# EAGLE design whip-o-diffusor_v1.0 (EAGLE 5.11)
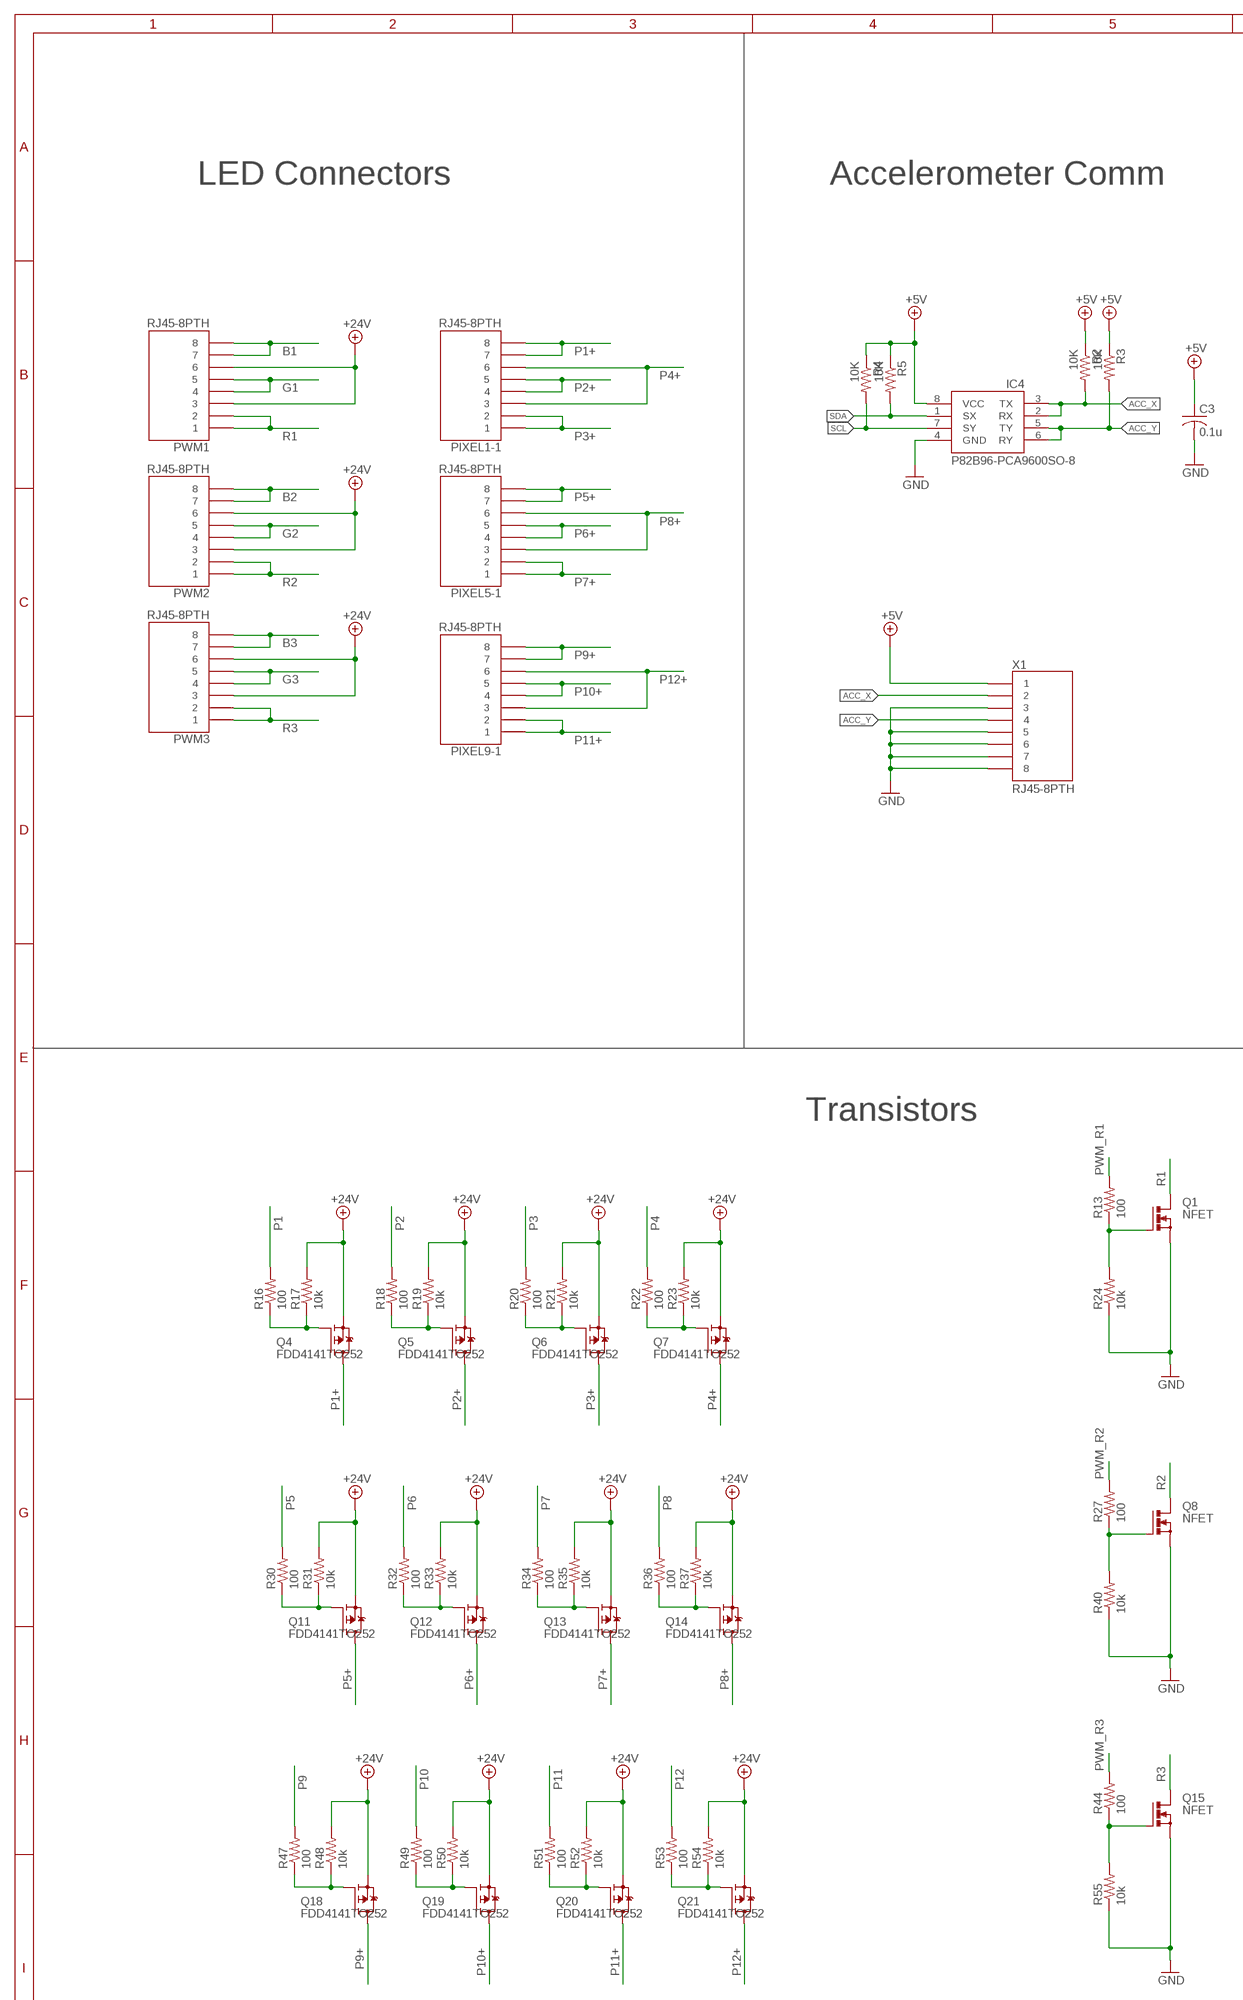
[diagram p0: schematic, sheet 1, part 1 of 2]
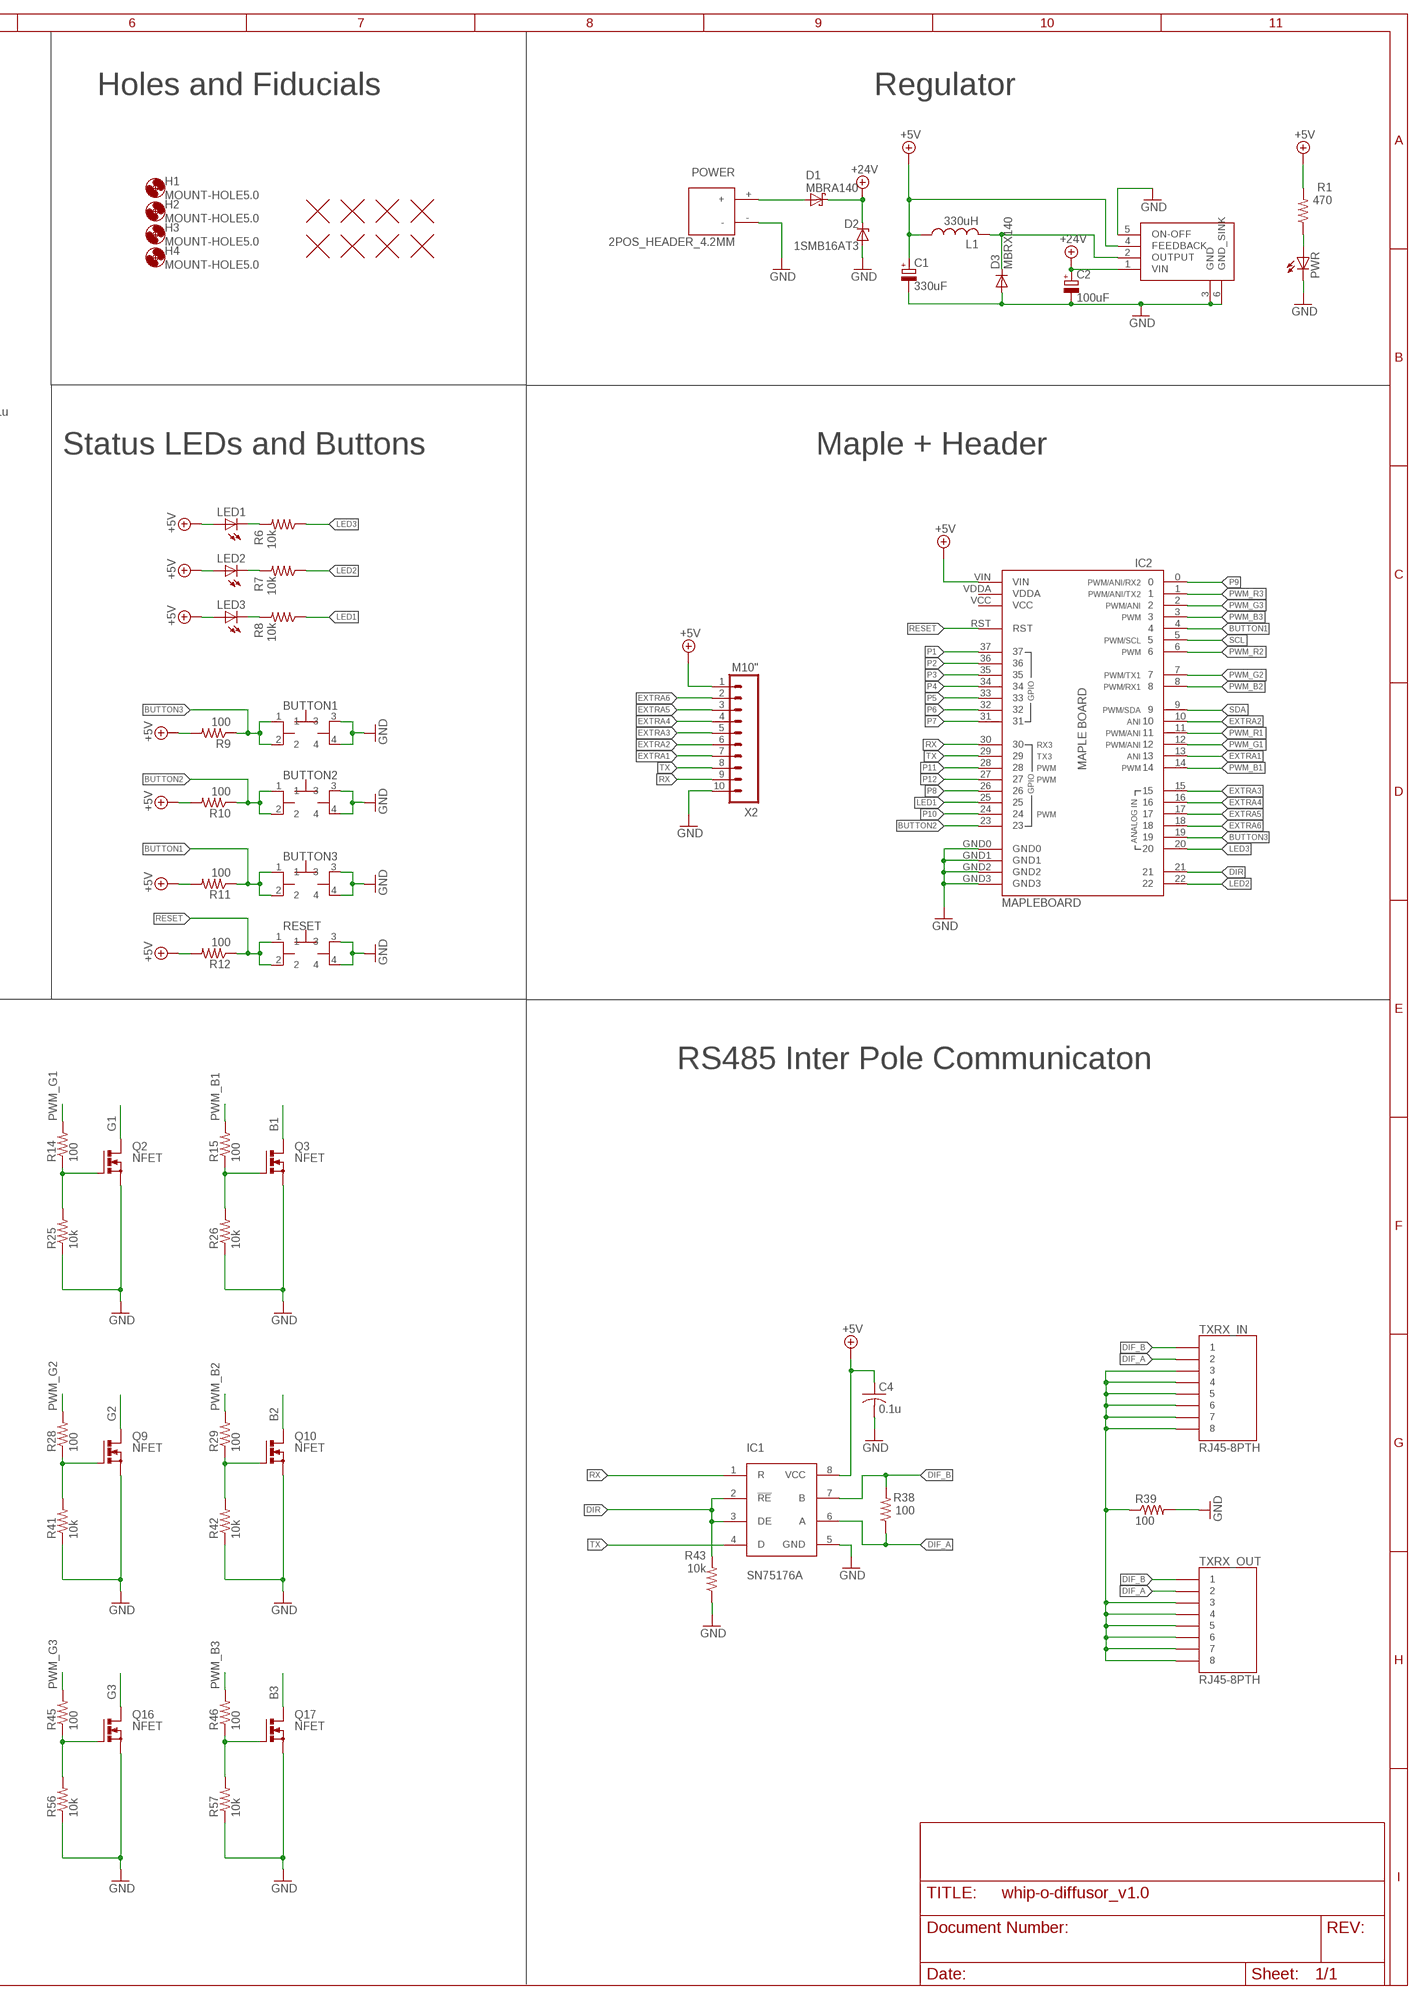
[diagram p1: schematic, sheet 1, part 2 of 2]

## Parts
BUTTON1  TL3301  [TL3301]
BUTTON2  TL3301  [TL3301]
BUTTON3  TL3301  [TL3301]
C1  330uF  CPOL-EUE  [PANASONIC_E]
C2  100uF  CPOL-EUD  [PANASONIC_D]
C3  0.1u  C-USC0805  [C0805]
C4  0.1u  C-USC0805  [C0805]
D1  MBRA140  [SMA]
D2  1SMB16AT3  ZENER-DIODESMB  [SMB]
D3  MBRX140  DIODE-SOD123  [SOD123]
H1  MOUNT-HOLE5.0  [5,0]
H2  MOUNT-HOLE5.0  [5,0]
H3  MOUNT-HOLE5.0  [5,0]
H4  MOUNT-HOLE5.0  [5,0]
IC1  SN75176A  [SO-08]
IC2  MAPLEBOARD  [MAPLEBOARD]
IC3  TL2575  [TO-263-5]
IC4  P82B96-PCA9600SO-8  [SO-8]
L1  330uH  L-USL4532P  [L4532P]
LED1  LEDCHIP-LED0805  [CHIP-LED0805]
LED2  LEDCHIP-LED0805  [CHIP-LED0805]
LED3  LEDCHIP-LED0805  [CHIP-LED0805]
PIXEL1-1  RJ45-8PTH  [RJ45-8]
PIXEL5-1  RJ45-8PTH  [RJ45-8]
PIXEL9-1  RJ45-8PTH  [RJ45-8]
POWER  2POS_HEADER_4.2MM  [2POS_HEADER_4.2MM]
PWM1  RJ45-8PTH  [RJ45-8]
PWM2  RJ45-8PTH  [RJ45-8]
PWM3  RJ45-8PTH  [RJ45-8]
PWR  LEDCHIP-LED0805  [CHIP-LED0805]
Q1  NFET  [TO252]
Q2  NFET  [TO252]
Q3  NFET  [TO252]
Q4  FDD4141TO252  [TO252]
Q5  FDD4141TO252  [TO252]
Q6  FDD4141TO252  [TO252]
Q7  FDD4141TO252  [TO252]
Q8  NFET  [TO252]
Q9  NFET  [TO252]
Q10  NFET  [TO252]
Q11  FDD4141TO252  [TO252]
Q12  FDD4141TO252  [TO252]
Q13  FDD4141TO252  [TO252]
Q14  FDD4141TO252  [TO252]
Q15  NFET  [TO252]
Q16  NFET  [TO252]
Q17  NFET  [TO252]
Q18  FDD4141TO252  [TO252]
Q19  FDD4141TO252  [TO252]
Q20  FDD4141TO252  [TO252]
Q21  FDD4141TO252  [TO252]
R1  470  R-US_R0805  [R0805]
R2  10K  R-US_R0603  [R0603]
R3  10K  R-US_R0603  [R0603]
R4  10K  R-US_R0603  [R0603]
R5  10K  R-US_R0603  [R0603]
R6  10k  R-US_R0805  [R0805]
R7  10k  R-US_R0805  [R0805]
R8  10k  R-US_R0805  [R0805]
R9  100  R-US_R0603  [R0603]
R10  100  R-US_R0603  [R0603]
R11  100  R-US_R0603  [R0603]
R12  100  R-US_R0603  [R0603]
R13  100  R-US_R0603  [R0603]
R14  100  R-US_R0603  [R0603]
R15  100  R-US_R0603  [R0603]
R16  100  R-US_R0603  [R0603]
R17  10k  R-US_R0603  [R0603]
R18  100  R-US_R0603  [R0603]
R19  10k  R-US_R0603  [R0603]
R20  100  R-US_R0603  [R0603]
R21  10k  R-US_R0603  [R0603]
R22  100  R-US_R0603  [R0603]
R23  10k  R-US_R0603  [R0603]
R24  10k  R-US_R0603  [R0603]
R25  10k  R-US_R0603  [R0603]
R26  10k  R-US_R0603  [R0603]
R27  100  R-US_R0603  [R0603]
R28  100  R-US_R0603  [R0603]
R29  100  R-US_R0603  [R0603]
R30  100  R-US_R0603  [R0603]
R31  10k  R-US_R0603  [R0603]
R32  100  R-US_R0603  [R0603]
R33  10k  R-US_R0603  [R0603]
R34  100  R-US_R0603  [R0603]
R35  10k  R-US_R0603  [R0603]
R36  100  R-US_R0603  [R0603]
R37  10k  R-US_R0603  [R0603]
R38  100  R-US_R0805  [R0805]
R39  100  R-US_R2512  [R2512]
R40  10k  R-US_R0603  [R0603]
R41  10k  R-US_R0603  [R0603]
R42  10k  R-US_R0603  [R0603]
R43  10k  R-US_R0805  [R0805]
R44  100  R-US_R0603  [R0603]
R45  100  R-US_R0603  [R0603]
R46  100  R-US_R0603  [R0603]
R47  100  R-US_R0603  [R0603]
R48  10k  R-US_R0603  [R0603]
R49  100  R-US_R0603  [R0603]
R50  10k  R-US_R0603  [R0603]
R51  100  R-US_R0603  [R0603]
R52  10k  R-US_R0603  [R0603]
R53  100  R-US_R0603  [R0603]
R54  10k  R-US_R0603  [R0603]
R55  10k  R-US_R0603  [R0603]
R56  10k  R-US_R0603  [R0603]
R57  10k  R-US_R0603  [R0603]
RESET  TL3301  [TL3301]
TXRX_IN  RJ45-8PTH  [RJ45-8]
TXRX_OUT  RJ45-8PTH  [RJ45-8]
U$1  FIDUCIAL1X2  [FIDUCIAL-1X2]
U$2  FIDUCIAL1X2  [FIDUCIAL-1X2]
U$3  FIDUCIAL1X2  [FIDUCIAL-1X2]
U$4  FIDUCIAL1X2  [FIDUCIAL-1X2]
U$5  FIDUCIAL1X2  [FIDUCIAL-1X2]
U$6  FIDUCIAL1X2  [FIDUCIAL-1X2]
U$7  FIDUCIAL1X2  [FIDUCIAL-1X2]
U$8  FIDUCIAL1X2  [FIDUCIAL-1X2]
X1  RJ45-8PTH  [RJ45-8]
X2  M10"  [1X10]

## Nets
+5V: C1.+ C3.1 C4.1 IC1.8(VCC) IC2.VIN IC3.4(FEEDBACK) IC4.8(VCC) L1.1 LED1.A LED2.A LED3.A R1.2 R2.1 R3.1 R4.1 R5.1 R9.2 R10.2 R11.2 R12.2 X1.1 X2.1
+24V: C2.+ D1.K(C) D2.C IC3.1(VIN) PWM1.3 PWM1.6 PWM2.3 PWM2.6 PWM3.3 PWM3.6 Q4.S Q5.S Q6.S Q7.S Q11.S Q12.S Q13.S Q14.S Q18.S Q19.S Q20.S Q21.S R17.2 R19.2 R21.2 R23.2 R31.2 R33.2 R35.2 R37.2 R48.2 R50.2 R52.2 R54.2
ACC_X: IC4.2(RX) IC4.3(TX) R2.2 X1.2
ACC_Y: IC4.5(TY) IC4.6(RY) R3.2 X1.4
B1: PWM1.7 PWM1.8 Q3.2(D)
B2: PWM2.7 PWM2.8 Q10.2(D)
B3: PWM3.7 PWM3.8 Q17.2(D)
BUTTON1: BUTTON3.1 BUTTON3.2 IC2.4 R11.1
BUTTON2: BUTTON2.1 BUTTON2.2 IC2.23 R10.1
BUTTON3: BUTTON1.1 BUTTON1.2 IC2.19 R9.1
DIF_A: IC1.6(A) R38.1 TXRX_IN.2 TXRX_OUT.2
DIF_B: IC1.7(B) R38.2 TXRX_IN.1 TXRX_OUT.1
DIR: IC1.2(!RE) IC1.3(DE) IC2.21 R43.2
EXTRA1: IC2.13 X2.7
EXTRA2: IC2.10 X2.6
EXTRA3: IC2.15 X2.5
EXTRA4: IC2.16 X2.4
EXTRA5: IC2.17 X2.3
EXTRA6: IC2.18 X2.2
G1: PWM1.4 PWM1.5 Q2.2(D)
G2: PWM2.4 PWM2.5 Q9.2(D)
G3: PWM3.4 PWM3.5 Q16.2(D)
GND: BUTTON1.3 BUTTON1.4 BUTTON2.3 BUTTON2.4 BUTTON3.3 BUTTON3.4 C1.- C2.- C3.2 C4.2 D2.A D3.A IC1.5(GND) IC2.GND0 IC2.GND1 IC2.GND2 IC2.GND3 IC3.3(GND) IC3.5(ON-OFF) IC3.6(GND_SINK) IC4.4(GND) POWER.- PWR.C Q1.3(S) Q2.3(S) Q3.3(S) Q8.3(S) Q9.3(S) Q10.3(S) Q15.3(S) Q16.3(S) Q17.3(S) R24.1 R25.1 R26.1 R39.2 R40.1 R41.1 R42.1 R43.1 R55.1 R56.1 R57.1 RESET.3 RESET.4 X1.3 X1.5 X1.6 X1.7 X1.8 X2.10
LED1: IC2.25 R8.1
LED2: IC2.22 R7.1
LED3: IC2.20 R6.1
N$1: PWR.A R1.1
N$2: Q2.1(G) R14.1 R25.2
N$3: Q18.G R47.1 R48.1
N$4: D3.C IC3.2(OUTPUT) L1.2
N$5: D1.A POWER.+
N$6: Q19.G R49.1 R50.1
N$7: R39.1 TXRX_IN.3 TXRX_IN.4 TXRX_IN.5 TXRX_IN.6 TXRX_IN.7 TXRX_IN.8 TXRX_OUT.3 TXRX_OUT.4 TXRX_OUT.5 TXRX_OUT.6 TXRX_OUT.7 TXRX_OUT.8
N$8: Q3.1(G) R15.1 R26.2
N$9: Q20.G R51.1 R52.1
N$10: Q8.1(G) R27.1 R40.2
N$11: LED3.C R8.2
N$12: Q9.1(G) R28.1 R41.2
N$13: Q13.G R34.1 R35.1
N$14: Q10.1(G) R29.1 R42.2
N$15: Q14.G R36.1 R37.1
N$16: Q15.1(G) R44.1 R55.2
N$17: Q21.G R53.1 R54.1
N$18: Q16.1(G) R45.1 R56.2
N$19: Q1.1(G) R13.1 R24.2
N$20: LED2.C R7.2
N$21: Q17.1(G) R46.1 R57.2
N$22: Q5.G R18.1 R19.1
N$23: Q6.G R20.1 R21.1
N$24: Q4.G R16.1 R17.1
N$25: Q7.G R22.1 R23.1
N$26: Q11.G R30.1 R31.1
N$27: Q12.G R32.1 R33.1
N$28: LED1.C R6.2
P1: IC2.37 R16.2
P1+: PIXEL1-1.7 PIXEL1-1.8 Q4.D
P2: IC2.36 R18.2
P2+: PIXEL1-1.4 PIXEL1-1.5 Q5.D
P3: IC2.35 R20.2
P3+: PIXEL1-1.1 PIXEL1-1.2 Q6.D
P4: IC2.34 R22.2
P4+: PIXEL1-1.3 PIXEL1-1.6 Q7.D
P5: IC2.33 R30.2
P5+: PIXEL5-1.7 PIXEL5-1.8 Q11.D
P6: IC2.32 R32.2
P6+: PIXEL5-1.4 PIXEL5-1.5 Q12.D
P7: IC2.31 R34.2
P7+: PIXEL5-1.1 PIXEL5-1.2 Q13.D
P8: IC2.26 R36.2
P8+: PIXEL5-1.3 PIXEL5-1.6 Q14.D
P9: IC2.0 R47.2
P9+: PIXEL9-1.7 PIXEL9-1.8 Q18.D
P10: IC2.24 R49.2
P10+: PIXEL9-1.4 PIXEL9-1.5 Q19.D
P11: IC2.28 R51.2
P11+: PIXEL9-1.1 PIXEL9-1.2 Q20.D
P12: IC2.27 R53.2
P12+: PIXEL9-1.3 PIXEL9-1.6 Q21.D
PWM_B1: IC2.14 R15.2
PWM_B2: IC2.8 R29.2
PWM_B3: IC2.3 R46.2
PWM_G1: IC2.12 R14.2
PWM_G2: IC2.7 R28.2
PWM_G3: IC2.2 R45.2
PWM_R1: IC2.11 R13.2
PWM_R2: IC2.6 R27.2
PWM_R3: IC2.1 R44.2
R1: PWM1.1 PWM1.2 Q1.2(D)
R2: PWM2.1 PWM2.2 Q8.2(D)
R3: PWM3.1 PWM3.2 Q15.2(D)
RESET: IC2.RST R12.1 RESET.1 RESET.2
RX: IC1.1(R) IC2.30 X2.9
SCL: IC2.5 IC4.7(SY) R4.2
SDA: IC2.9 IC4.1(SX) R5.2
TX: IC1.4(D) IC2.29 X2.8
Unconnected: IC2.VCC IC2.VDDA

## Notes on the sheet
- Holes and Fiducials | Regulator
- LED Connectors | Accelerometer Comm
- Status LEDs and Buttons | Maple + Header
- Transistors | RS485 Inter Pole Communicaton

## Library data of the parts
BUTTON1-BUTTON3 RESET = E-switch:TL3301
C1 C2 = rcl:CPOL-EU: POLARIZED CAPACITOR, European symbol
C3 C4 = rcl:C-US: CAPACITOR, American symbol
D1 = diode:MBRA140
D2 = diode:ZENER-DIODE: Z-Diode
D3 = diode:DIODE-: DIODE
H1-H4 = holes:MOUNT-HOLE: MOUNTING HOLE with drill center marker
IC1 = texas:SN75176A: Transceiver RS422
IC2 = NITWHIPS:MAPLEBOARD
IC3 = vincent:TL2575
IC4 = Sparky:P82B96-PCA9600: P822B96 and PCA9600, bipolar IC creating a non-latching, bidirectional, logic interface between the normal I2C bus and a range of other bus configuration icluding rs485.
L1 = rcl:L-US: INDUCTOR, American symbol
LED1-LED3 PWR = led:LED: LED OSRAM: - CHIPLED LG R971, LG N971, LY N971, LG Q971, LY Q971, LO R971, LY R971 LH N974, LH R974 LS Q976, LO Q976, LY Q976 LO Q996 - Hyper CHIPLED LW Q18S LB Q993, LB Q99A, LB R99A - SideLED LS A670, LO A670, LY A670, LG A670, LP A670 LB A673, LV A673, LT A673, LW A673 LH A674 LY A675 LS A676, LA A676, LO A676, LY A676, LW A676 LS A679, LY A679, LG A679 - Hyper Micro SIDELED® LS Y876, LA Y876, LO Y876, LY Y876 LT Y87S - SmartLED LW L88C, LW L88S LB L89C, LB L89S, LG L890 LS L89K, LO L89K, LY L89K LS L896, LA L896, LO L896, LY L896 - TOPLED LS T670, LO T670, LY T670, LG T670, LP T670 LSG T670, LSP T670, LSY T670, LOP T670, LYG T670 LG T671, LOG T671, LSG T671 LB T673, LV T673, LT T673, LW T673 LH T674 LS T676, LA T676, LO T676, LY T676, LB T676, LH T676, LSB T676, LW T676 LB T67C, LV T67C, LT T67C, LS T67K, LO T67K, LY T67K, LW E67C LS E67B, LA E67B, LO E67B, LY E67B, LB E67C, LV E67C, LT E67C LW T67C LS T679, LY T679, LG T679 LS T770, LO T770, LY T770, LG T770, LP T770 LB T773, LV T773, LT T773, LW T773 LH T774 LS E675, LA E675, LY E675, LS T675 LS T776, LA T776, LO T776, LY T776, LB T776 LHGB T686 LT T68C, LB T68C - Hyper Mini TOPLED® LB M676 - Mini TOPLED Santana® LG M470 LS M47K, LO M47K, LY M47K Source: http://www.osram.convergy.de LUXEON: - LUMILED® LXK2-PW12-R00, LXK2-PW12-S00, LXK2-PW14-U00, LXK2-PW14-V00 LXK2-PM12-R00, LXK2-PM12-S00, LXK2-PM14-U00 LXK2-PE12-Q00, LXK2-PE12-R00, LXK2-PE12-S00, LXK2-PE14-T00, LXK2-PE14-U00 LXK2-PB12-K00, LXK2-PB12-L00, LXK2-PB12-M00, LXK2-PB14-N00, LXK2-PB14-P00, LXK2-PB14-Q00 LXK2-PR12-L00, LXK2-PR12-M00, LXK2-PR14-Q00, LXK2-PR14-R00 LXK2-PD12-Q00, LXK2-PD12-R00, LXK2-PD12-S00 LXK2-PH12-R00, LXK2-PH12-S00 LXK2-PL12-P00, LXK2-PL12-Q00, LXK2-PL12-R00 Source: www.luxeon.com KINGBRIGHT: KA-3528ASYC Source: www.kingbright.com
PIXEL1-1 PIXEL5-1 PIXEL9-1 PWM1-PWM3 TXRX_IN TXRX_OUT X1 = SparkFun:RJ45-8: RJ45 Jack Simple RJ45, 8-pin connection - connector for common Cat5, Cat5e, and Cat6 Ethernet cables. Footprint not yet proven in production. Connector sku is PRT-00643; Breakout PCB sku is BOB-00716.
POWER = vadim:2POS_HEADER_4.2MM
Q1-Q3 Q8-Q10 Q15-Q17 = vincent:NFET
Q4-Q7 Q11-Q14 Q18-Q21 = transistor-fet:FDD4141: P-Channel PowerTrench® MOSFET Source: FDD4141.pdf
R1-R57 = rcl:R-US_: RESISTOR, American symbol
U$1-U$8 = SparkFunEagle-6-6-07:FIDUCIAL: Fiducial Alignment Points Various fiducial points for machine vision alignment.
X2 = SparkFun:M10: Header 10 Standard 10-pin 0.1" header. Use with straight break away headers (SKU : PRT-00116), right angle break away headers (PRT-00553), swiss pins (PRT-00743), machine pins (PRT-00117), and female headers (PRT-00115).

## Net classes
1 power: width 1.27 mm, clearance 0.254 mm

## Board
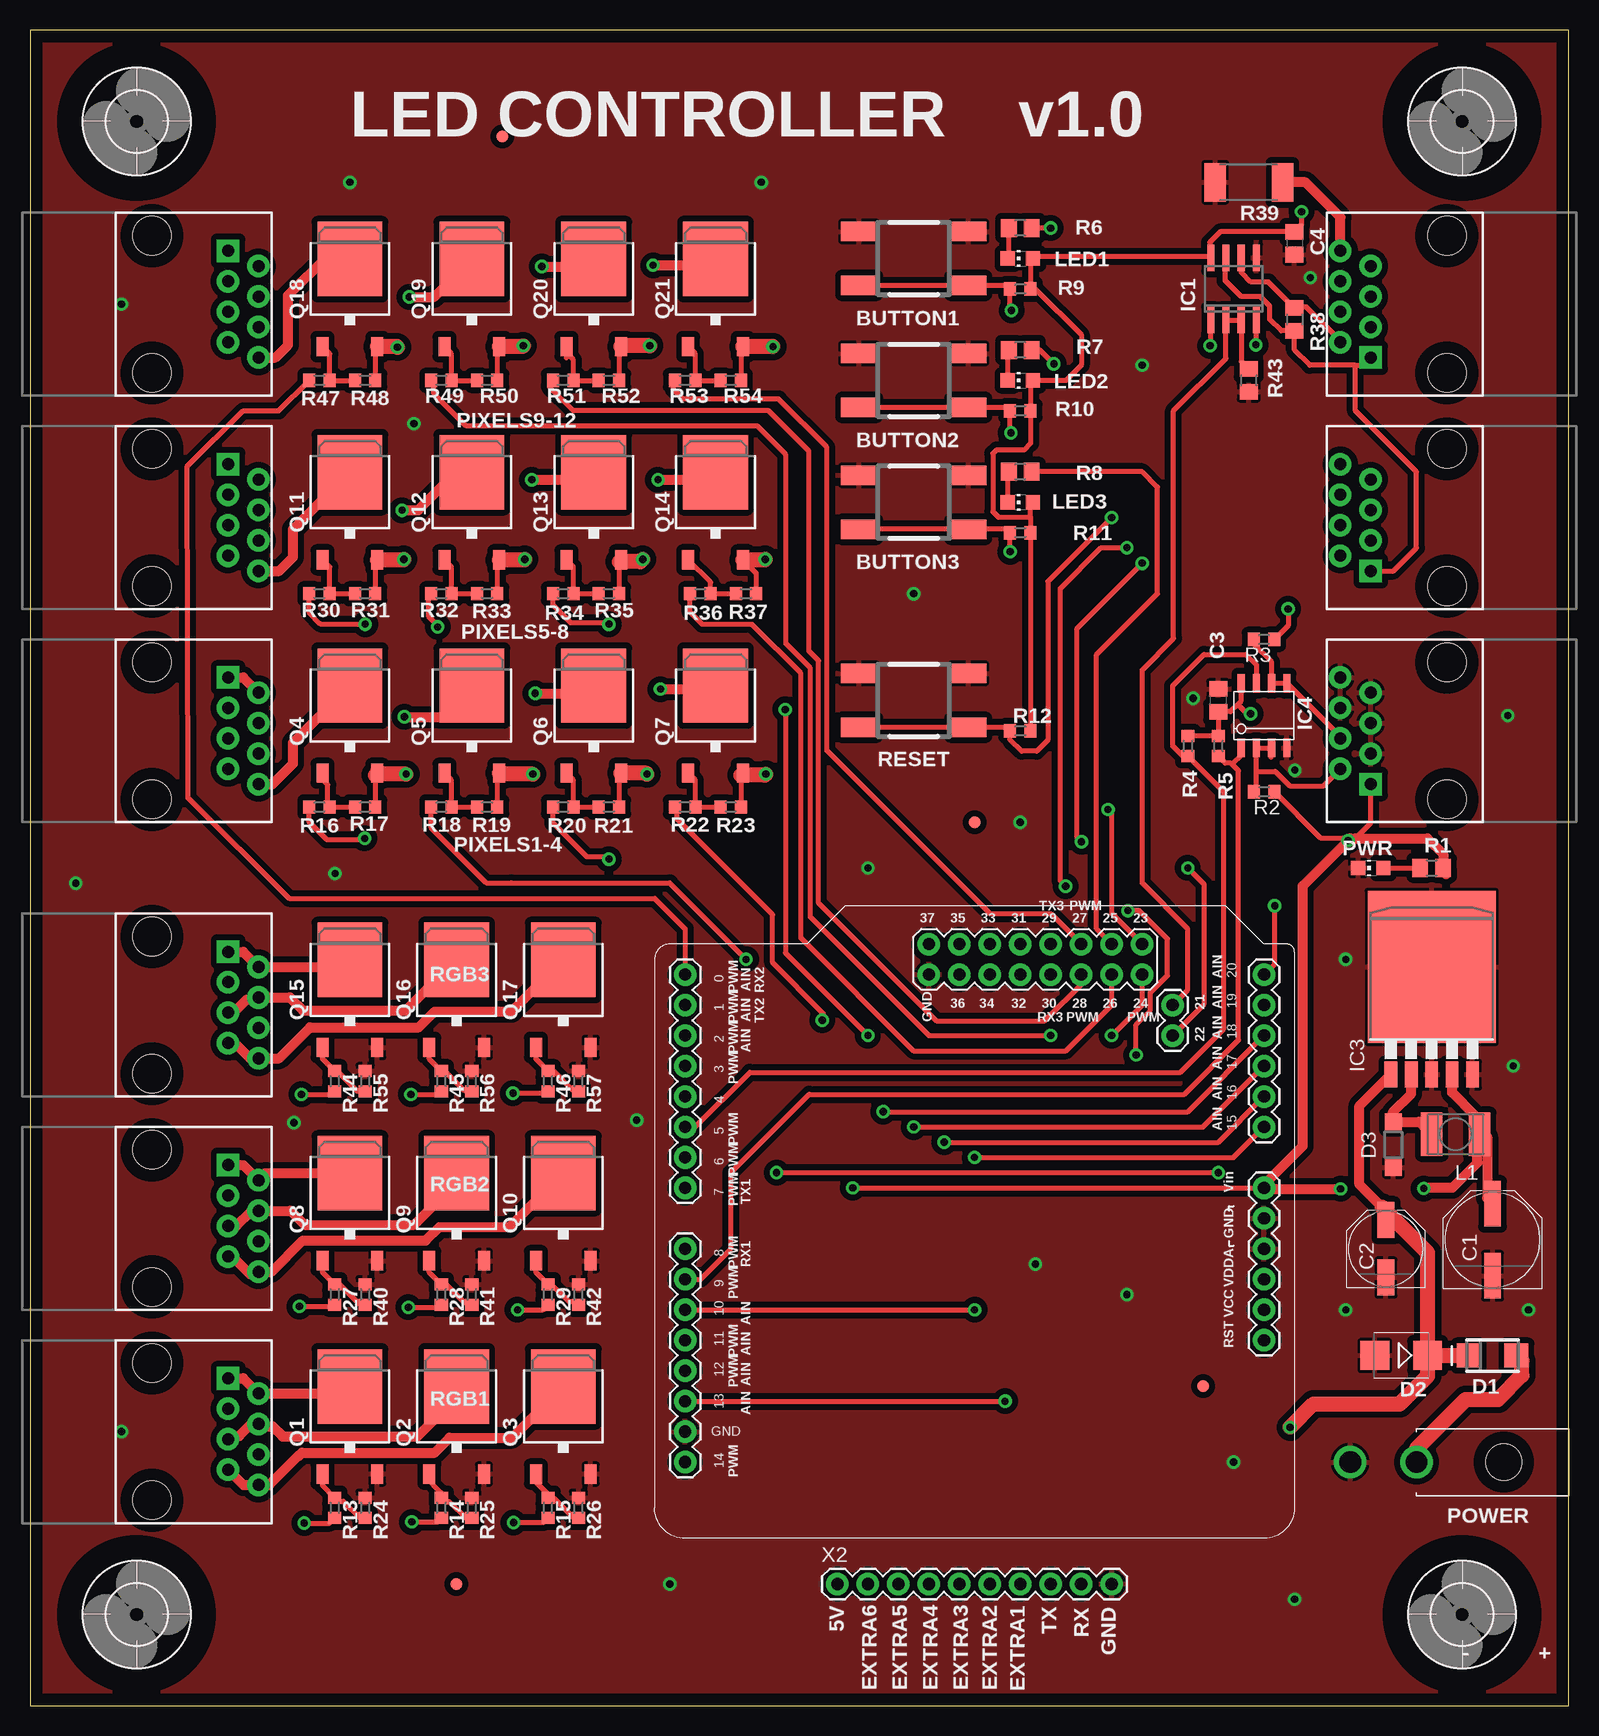
[diagram p2: board, top side]
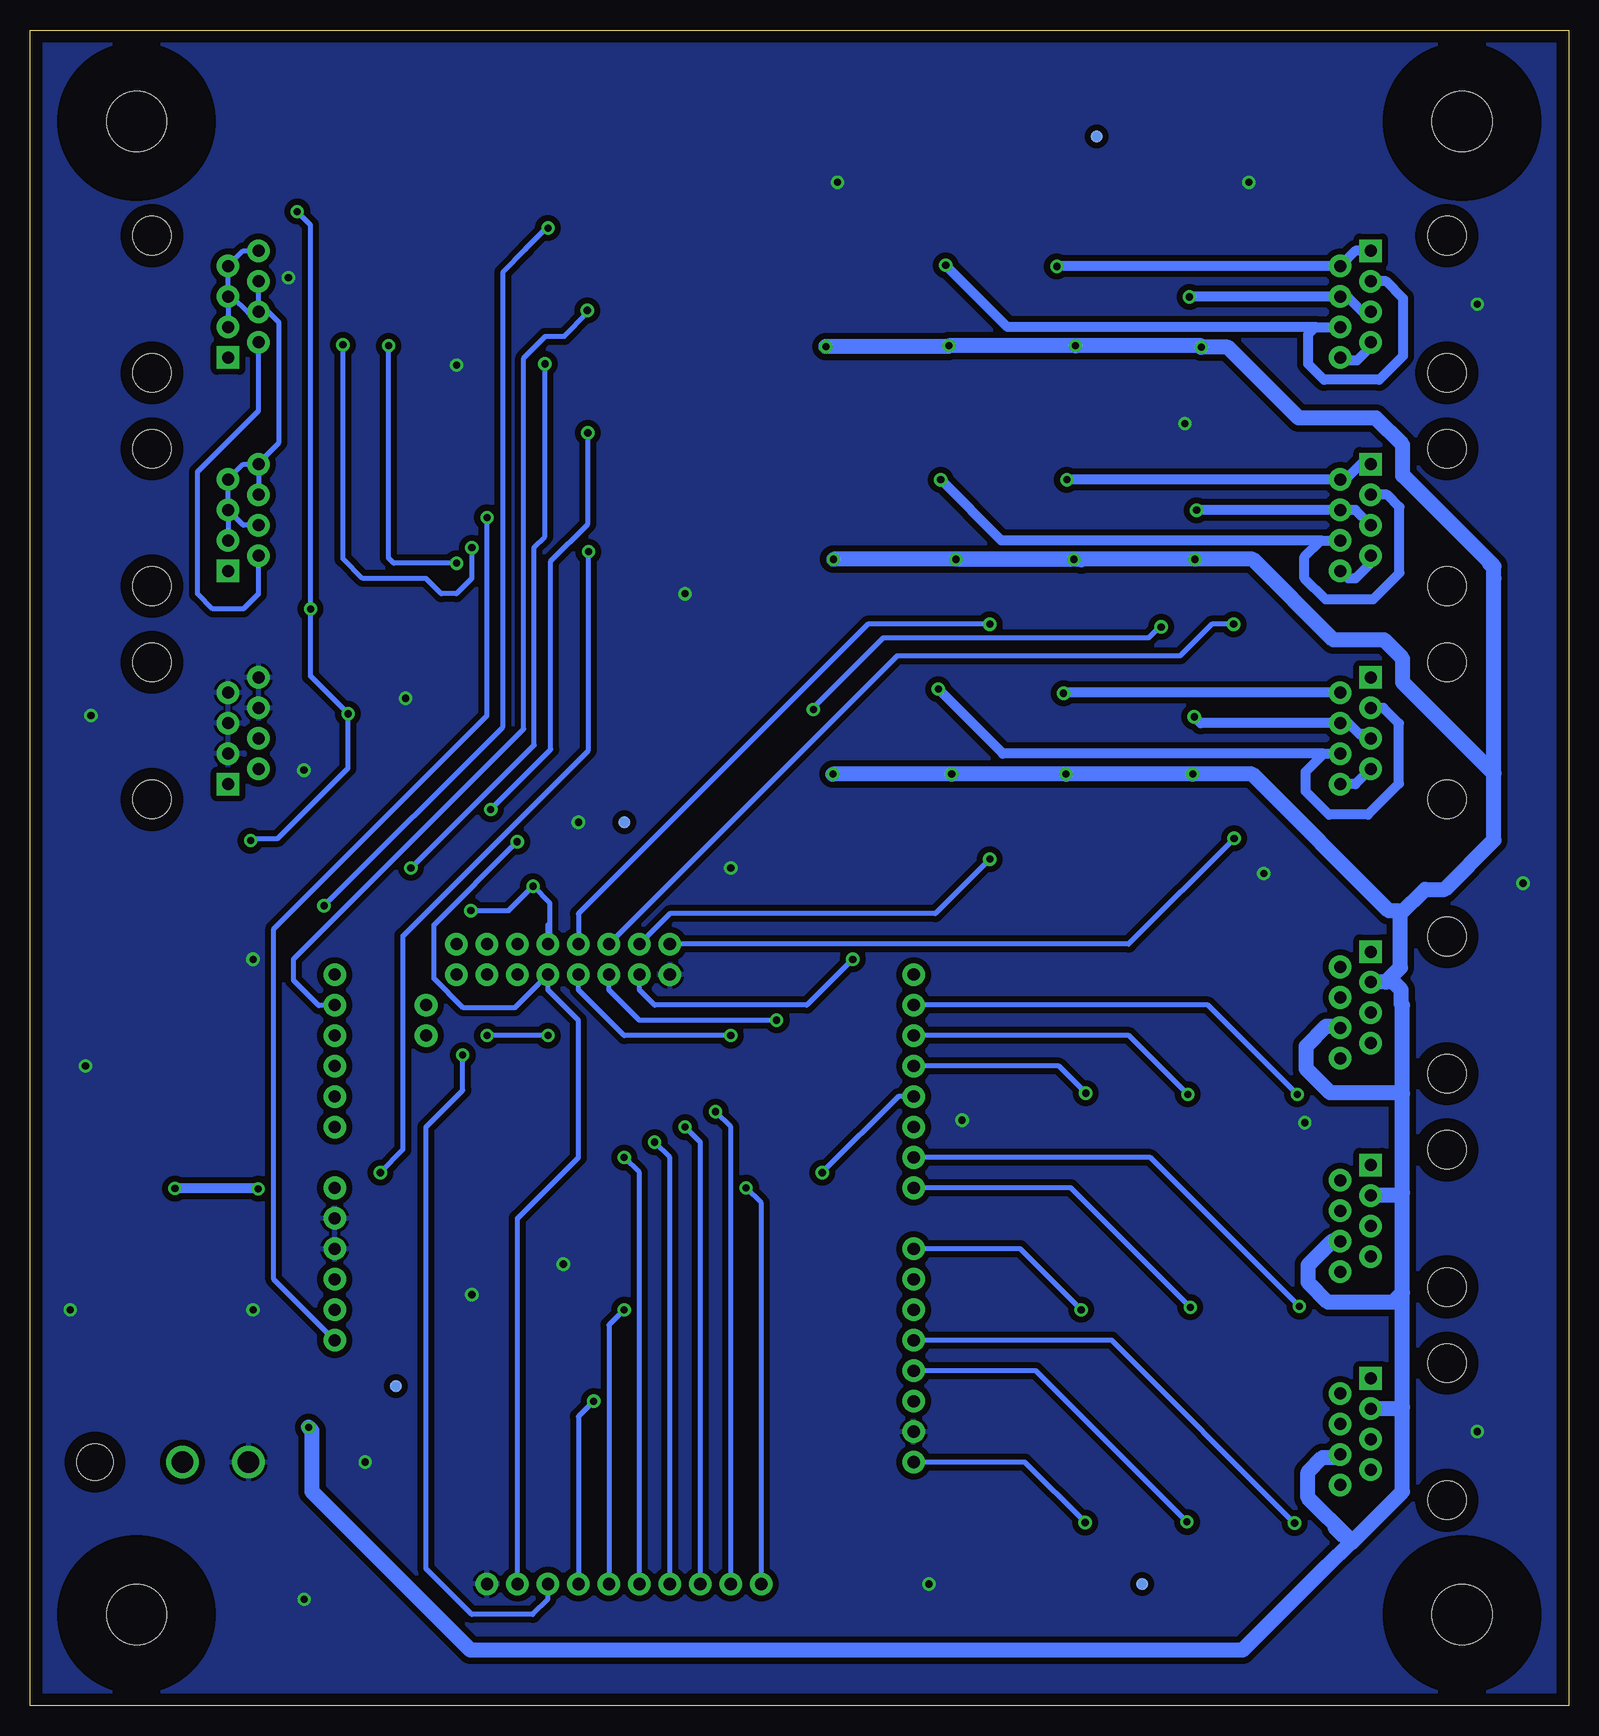
[diagram p3: board, bottom side, seen from below]

Size 128.27 x 139.7 mm. Coordinates in mm from the lower left corner, seen from the top.
Outline: 0,0 128.27,0 128.27,139.7 0,139.7 0,0
Copper layers (1*2+15*16): Top 0.0356mm / dielectric 0.5004mm / Route2 0.0356mm / dielectric 0.5004mm / Route15 0.0356mm / dielectric 0.5004mm / Bottom 0.0356mm
Design rules "ESKI_design_rules": minimum track width 8mil, minimum drill 15mil, track to track 7mil, track to pad 7mil, pad to pad 7mil, via to via 7mil, smd to smd 6mil, copper to edge 40mil, drill to drill 8mil, minimum pad ring 10mil, minimum via ring 10mil, stop-mask expansion 4mil, vias tented up to drill 50mil, thermal gap 10mil

### Footprints (pad centres in the part's own frame; a part is rotated, then mirrored left to right if it is on the bottom)
TL3301 = smd 3 x 1.6: 1 -4.55,2.25; 2 4.55,2.25; 3 -4.55,-2.25; 4 4.55,-2.25
PANASONIC_E = smd 3.8 x 1.4: + 3,0; - -3,0
PANASONIC_D = smd 3 x 1.4: + 2.4,0; - -2.4,0
C0805 = smd 1.3 x 1.5: 1 -0.95,0; 2 0.95,0
SMA = smd 1.999 x 1.999: A -1.994,0; K 1.994,0
SMB = smd 2.4 x 2.4: A 2.2,0; C -2.2,0
SOD123 = smd 1.4 x 1.4: A 1.9,0; C -1.9,0
5,0 = hole 5: 0,0
SO-08 = smd 0.6 x 2.2: 1 -1.905,-2.6; 2 -0.635,-2.6; 3 0.635,-2.6; 4 1.905,-2.6; 5 1.905,2.6; 6 0.635,2.6; 7 -0.635,2.6; 8 -1.905,2.6
MAPLEBOARD = drill 1.016 pad 1.88 round: 0 46.99,50.8; 1 44.45,50.8; 2 41.91,50.8; 3 39.37,50.8; 4 36.83,50.8; 5 34.29,50.8; 6 31.75,50.8; 7 29.21,50.8; 8 24.13,50.8; 9 21.59,50.8; 10 19.05,50.8; 11 16.51,50.8; 12 13.97,50.8; 13 11.43,50.8; 14 6.35,50.8; 15 34.29,2.54; 16 36.83,2.54; 17 39.37,2.54; 18 41.91,2.54; 19 44.45,2.54; 20 46.99,2.54; 21 44.45,10.16; 22 41.91,10.16; 23 49.53,12.7; 24 46.99,12.7; 25 49.53,15.24; 26 46.99,15.24; 27 49.53,17.78; 28 46.99,17.78; 29 49.53,20.32; 30 46.99,20.32; 31 49.53,22.86; 32 46.99,22.86; 33 49.53,25.4; 34 46.99,25.4; 35 49.53,27.94; 36 46.99,27.94; 37 49.53,30.48; GND0 8.89,50.8; GND1 46.99,30.48; GND2 26.67,2.54; GND3 24.13,2.54; RST 16.51,2.54; VCC 19.05,2.54; VDDA 21.59,2.54; VIN 29.21,2.54
TO-263-5 = smd 1.067 x 2.159: 1 -3.404,-5.791; 2 -1.702,-5.791; 3 0,-5.791; 4 1.702,-5.791; 5 3.404,-5.791 | smd 10.668 x 12.7: 6 0,3.175
SO-8 = smd 0.6 x 1.55: 1 -1.905,-2.7; 2 -0.635,-2.7; 3 0.635,-2.7; 4 1.905,-2.7; 5 1.905,2.7; 6 0.635,2.7; 7 -0.635,2.7; 8 -1.905,2.7
L4532P = smd 1.8 x 3.6: 1 -2,0; 2 2,0
CHIP-LED0805 = smd 1.2 x 1.2: A 0,-1.05; C 0,1.05
RJ45-8 = drill 1 pad 1.88 square: 1 -4.445,6.35 | drill 1 pad 1.88 round: 2 -3.175,8.89; 3 -1.905,6.35; 4 -0.635,8.89; 5 0.635,6.35; 6 1.905,8.89; 7 3.175,6.35; 8 4.445,8.89 | hole 3.2: -5.715,0; 5.715,0
2POS_HEADER_4.2MM = drill 1.803 round: + 0,0; - -5.512,0 | hole 2.997: 7.29,0
TO252 = smd 1 x 1.6: 1 -2.28,-4.8; 3 2.28,-4.8 | smd 5.4 x 6.2: 2 0,2.5
TO252' = smd 5.4 x 6.2: D 0,2.5 | smd 1 x 1.6: G -2.28,-4.8; S 2.28,-4.8
R0805 = smd 1.3 x 1.5: 1 -0.95,0; 2 0.95,0
R0603 = smd 1 x 1.1: 1 -0.85,0; 2 0.85,0
R2512 = smd 1.8 x 3.2: 1 -2.8,0; 2 2.8,0
FIDUCIAL-1X2 = smd 1 x 1: 1 0,0
1X10 = drill 1.016 pad 1.88 round: 1 0,0; 2 2.54,0; 3 5.08,0; 4 7.62,0; 5 10.16,0; 6 12.7,0; 7 15.24,0; 8 17.78,0; 9 20.32,0; 10 22.86,0

### Placement (x,y rotation side)
BUTTON1  73.66,120.65 180 top
BUTTON2  73.66,110.49 180 top
BUTTON3  73.66,100.33 180 top
C1  121.92,38.86 90 top
C2  113.03,38.1 90 top
C3  99.06,83.82 90 top
C4  105.41,121.92 270 top
D1  121.92,29.21 180 top
D2  114.3,29.21 180 top
D3  113.64,46.79 270 top
H1  8.89,7.62 0 top
H2  8.89,132.08 0 top
H3  119.38,7.62 0 top
H4  119.38,132.08 0 top
IC1  100.33,118.11 0 top
IC2  105.41,13.97 90 top
IC3  116.84,58.42 0 top
IC4  102.87,82.55 0 top
L1  118.85,47.65 180 top
LED1  82.55,120.65 90 top
LED2  82.55,110.49 90 top
LED3  82.55,100.33 90 top
PIXEL1-1  10.16,81.28 270 top
PIXEL5-1  10.16,99.06 270 top
PIXEL9-1  10.16,116.84 270 top
POWER  115.57,20.32 0 top
PWM1  10.16,22.86 270 top
PWM2  10.16,40.64 270 top
PWM3  10.16,58.42 270 top
PWR  111.76,69.85 90 top
Q1  26.67,24.13 0 top
Q2  35.56,24.13 0 top
Q3  44.45,24.13 0 top
Q4  FDD4141TO252  [TO252']  26.67,82.55 0 top
Q5  FDD4141TO252  [TO252']  36.83,82.55 0 top
Q6  FDD4141TO252  [TO252']  46.99,82.55 0 top
Q7  FDD4141TO252  [TO252']  57.15,82.55 0 top
Q8  26.67,41.91 0 top
Q9  35.56,41.91 0 top
Q10  44.45,41.91 0 top
Q11  FDD4141TO252  [TO252']  26.67,100.33 0 top
Q12  FDD4141TO252  [TO252']  36.83,100.33 0 top
Q13  FDD4141TO252  [TO252']  46.99,100.33 0 top
Q14  FDD4141TO252  [TO252']  57.15,100.33 0 top
Q15  26.67,59.69 0 top
Q16  35.56,59.69 0 top
Q17  44.45,59.69 0 top
Q18  FDD4141TO252  [TO252']  26.67,118.11 0 top
Q19  FDD4141TO252  [TO252']  36.83,118.11 0 top
Q20  FDD4141TO252  [TO252']  46.99,118.11 0 top
Q21  FDD4141TO252  [TO252']  57.15,118.11 0 top
R1  116.84,69.85 0 top
R2  102.87,76.2 180 top
R3  102.87,88.9 180 top
R4  96.52,80.01 270 top
R5  99.06,80.01 270 top
R6  82.55,123.19 180 top
R7  82.55,113.03 180 top
R8  82.55,102.87 180 top
R9  82.55,118.11 0 top
R10  82.55,107.95 0 top
R11  82.55,97.79 0 top
R12  82.55,81.28 0 top
R13  25.4,16.51 270 top
R14  34.29,16.51 270 top
R15  43.18,16.51 270 top
R16  24.13,74.93 180 top
R17  27.94,74.93 0 top
R18  34.29,74.93 180 top
R19  38.1,74.93 0 top
R20  44.45,74.93 180 top
R21  48.26,74.93 0 top
R22  54.61,74.93 180 top
R23  58.42,74.93 0 top
R24  27.94,16.51 270 top
R25  36.83,16.51 270 top
R26  45.72,16.51 270 top
R27  25.4,34.29 270 top
R28  34.29,34.29 270 top
R29  43.18,34.29 270 top
R30  24.13,92.71 180 top
R31  27.94,92.71 0 top
R32  34.29,92.71 180 top
R33  38.1,92.71 0 top
R34  44.45,92.71 180 top
R35  48.26,92.71 0 top
R36  55.88,92.71 180 top
R37  59.69,92.71 0 top
R38  105.41,115.57 270 top
R39  101.6,127 180 top
R40  27.94,34.29 270 top
R41  36.83,34.29 270 top
R42  45.72,34.29 270 top
R43  101.6,110.49 90 top
R44  25.4,52.07 270 top
R45  34.29,52.07 270 top
R46  43.18,52.07 270 top
R47  24.13,110.49 180 top
R48  27.94,110.49 0 top
R49  34.29,110.49 180 top
R50  38.1,110.49 0 top
R51  44.45,110.49 180 top
R52  48.26,110.49 0 top
R53  54.61,110.49 180 top
R54  58.42,110.49 0 top
R55  27.94,52.07 270 top
R56  36.83,52.07 270 top
R57  45.72,52.07 270 top
RESET  73.66,83.82 180 top
TXRX_IN  118.11,116.84 90 top
TXRX_OUT  118.11,99.06 90 top
U$1  35.56,10.16 0 top
U$2  35.56,10.16 0 bottom
U$3  97.79,26.67 0 top
U$4  97.79,26.67 0 bottom
U$5  78.74,73.66 0 bottom
U$6  78.74,73.66 0 top
U$7  39.37,130.81 0 bottom
U$8  39.37,130.81 0 top
X1  118.11,81.28 90 top
X2  67.31,10.16 0 top

### Tracks (layer width: path | path; a pad name or v marks a point on that pad's centre or on a via)
+5V  (via drill 0.6)
  Top 0.406: 98.35,120.79 98.35,122 99.22,122.87 C4.1 105.99,123.45 v105.99,124.56 | 98.35,120.79 IC1.8 | R4.1 R5.1 C3.1 100.07,82.87 100.67,83.48 | 100.67,83.48 100.97,83.77 IC4.8 | v101.75,82.7 101.45,82.7 100.67,83.48 | 83.4,99.06 R11.2 | 83.4,99.06 83.4,99.91 83.82,100.33 LED3.A | 98.35,120.79 83.74,120.79 LED1.A 83.4,120.45 R9.2 83.82,118.11 87.63,114.3 87.63,111.76 86.36,110.49 LED2.A 83.4,110.29 R10.2 83.4,105.24 82.86,104.7 80.57,104.7 80.26,104.39 80.26,99.54 80.72,99.08 83.38,99.08 83.4,99.06 | R11.2 83.69,97.5 | v109.88,72.14 110.31,72.14 110.49,72.31 | v68.58,43.18 IC2.VIN | R11.2 R12.2 | R3.1 104.88,90.06 v104.88,91.44 | R2.1 107.61,72.31 110.49,72.31 | X1.1 111.76,73.58 110.49,72.31
  Top 0.813: R1.2 118.03,69.61 118.03,69.32 117.81,69.55 117.81,70.99 116.48,72.31 110.49,72.31 110.06,72.31 v109.88,72.14 106.1,68.35 106.1,46.66 102.87,43.43 IC2.VIN 102.95,43.1 v109.25,43.1 | IC3.4 118.54,51.13 120.47,49.2 120.47,48.26 | 120.47,48.26 120.47,48.02 L1.1 120.85,46.62 121.46,46 | C1.+ 121.46,42.32 121.46,47.45 120.65,48.26 | 120.65,48.26 120.65,45.26 118.59,43.2 116.26,43.2 v116.18,43.13 | 120.65,48.26 120.47,48.26
  Bottom 0.406: v101.75,82.7 101.8,82.65 | v101.75,82.7 104.88,85.83 v104.88,91.44 104.88,123.44 v105.99,124.56 | 102.34,43.46 102.59,43.46 IC2.VIN | X2.1 67.31,41.91 v68.58,43.18 | v101.75,82.7 101.75,78.17 107.61,72.31 109.7,72.31 v109.88,72.14
  Bottom 0.813: v116.18,43.13 109.27,43.13 v109.25,43.1
+24V  (via drill 0.6)
  Top 0.406: R52.2 49.11,113.15 Q20.S | R50.2 38.95,113.15 Q19.S | R48.2 28.79,113.15 Q18.S | R31.2 28.79,95.37 Q11.S | R33.2 38.95,95.37 Q12.S | R35.2 49.11,95.37 Q13.S | R37.2 60.54,94.42 Q14.S | R23.2 59.27,77.59 Q7.S | R21.2 49.11,77.59 Q6.S | R19.2 38.95,77.59 Q5.S | R17.2 28.79,77.59 Q4.S | R54.2 59.27,113.15 Q21.S
  Top 0.813: C2.+ 113.03,41.25 112.7,41.58 110.82,43.46 110.82,50.01 IC3.1
  Top 1.27: Q21.S v61.92,113.31 | v51.66,113.39 49.35,113.39 Q20.S | Q19.S 41.05,113.31 v41.12,113.39 | Q14.S 61.24,95.53 v61.29,95.58 | 59.27,77.59 61.26,77.59 v61.34,77.67 | Q11.S 31.12,95.53 v31.17,95.58 | Q12.S 41.2,95.53 v41.25,95.58 | 49.11,95.37 50.87,95.37 v51.08,95.58 | Q6.S 51.36,77.75 v51.44,77.67 | Q5.S 39.19,77.67 v41.91,77.67 | 28.79,77.59 28.87,77.67 v31.34,77.67 | Q18.S 30.58,113.31 v30.63,113.26 | D2.C 116.5,37.78 112.7,41.58 | D2.C D1.K | D2.C 116.5,27.5 114.17,25.17 106.98,25.17 v105.04,23.23
  Bottom 0.406: 6.58,95.2 6.58,94.31 6.25,93.98
  Bottom 0.813: 13.87,34.47 14.17,34.16 | PWM1.6 19.66,20.95 | 19.48,14.88 19.48,15.24 | 13.87,51.05 13.92,51.1
  Bottom 1.27: 13.87,24.92 13.87,17.86 18.16,13.56 18.26,13.56 | 13.87,24.92 13.87,34.47 13.87,42.8 | 13.87,42.8 13.87,51.05 13.87,58.42 13.97,58.52 13.97,59.69 14.61,60.33 15.24,60.33 | 15.24,60.33 PWM3.3 | PWM2.3 14.12,42.55 13.87,42.8 | PWM1.3 14.02,24.77 13.87,24.92 | 18.26,13.56 20.12,11.71 20.14,11.71 27.2,4.65 91.54,4.65 104.75,17.86 104.75,22.94 v105.04,23.23 | v61.92,113.31 51.74,113.31 v51.66,113.39 v41.12,113.39 30.63,113.39 v30.63,113.26 | v51.08,95.58 v41.25,95.58 v31.17,95.58 26.34,95.58 19.61,88.85 15.39,88.85 13.84,87.3 13.84,85.32 6.25,77.72 | v51.08,95.58 v61.29,95.58 | 6.25,77.72 6.25,72.16 10.34,68.07 11.99,68.07 14.02,66.04 | 14.02,66.04 14.02,61.54 15.24,60.33 | 13.84,102.59 13.84,102.51 | 13.84,102.59 13.84,105.13 16.08,107.37 22.5,107.37 28.4,113.26 v30.63,113.26 | 6.58,95.2 6.6,95.2 | 6.25,77.72 6.25,93.98 6.25,95 13.84,102.59 | v61.34,77.67 v51.44,77.67 v41.91,77.67 v31.34,77.67 26.39,77.67 14.99,66.27 14.25,66.27 14.02,66.04 | v51.08,95.58 40.69,95.58 40.64,95.53 | 13.92,51.1 19.89,51.1 21.89,53.11 21.89,54.99 20.22,56.67 19.2,56.67 PWM3.6 | PWM2.6 19.74,38.73 21.72,36.75 21.72,35.31 20.07,33.66 14.68,33.66 14.17,34.16 | 18.26,13.56 18.26,13.87 | 18.26,13.87 21.74,17.35 21.74,19.48 20.52,20.7 19.3,20.7 PWM1.6 | v30.63,113.26 30.68,113.31 | 18.26,13.87 18.26,13.89 18.47,14.1 18.69,14.1 19.48,14.88
ACC_X
  Top 0.406: 103.45,79.1 103.45,79.8 IC4.3 IC4.2 102.23,77.9 | R2.2 102.23,76.42 102.23,77.9 | 102.23,77.9 103.81,77.9 105.03,76.68 107.8,76.68 X1.2
ACC_Y
  Top 0.406: R3.2 102.02,88.48 103.5,87 IC4.6 IC4.5 109.22,80.81 X1.4
B1
  Top 0.813: PWM1.7 17.78,18.41 PWM1.8 19.94,18.41 22.35,20.83 22.4,20.83 22.68,21.11 33.73,21.11 34.98,22.35 40.17,22.35 Q3.2
B2
  Top 0.813: PWM2.7 16.84,37.47 18.31,35.99 18.85,35.99 PWM2.8 20.14,36.2 22.73,38.79 32.99,38.79 34.14,39.93 39.97,39.93 Q10.2
B3
  Top 0.813: PWM3.7 17.07,55.24 18.54,53.77 18.85,53.77 PWM3.8 20.75,53.98 23.34,56.57 32.41,56.57 33.73,57.89 40.15,57.89 Q17.2
BUTTON1  (via drill 0.6)
  Top 0.406: BUTTON3.2 BUTTON3.1 81.41,98.08 R11.1 v81.7,96.23 v81.71,96.22 | v62.23,44.45 v99.06,44.45
  Bottom 0.406: v81.71,96.22 81.71,79.65 97.18,64.19 97.18,46.38 v99.06,44.45 | IC2.4 55.88,50.8 v62.23,44.45
BUTTON2  (via drill 0.6)
  Top 0.406: BUTTON2.2 BUTTON2.1 81.41,108.24 R10.1 81.7,106.18 v81.76,106.12 | IC2.23 90.17,66.04 90.17,74.42 v89.86,74.73
  Bottom 0.406: v81.76,106.12 81.76,98.53 84.86,95.43 84.86,79.73 v89.86,74.73
BUTTON3  (via drill 0.6)
  Top 0.406: BUTTON1.2 BUTTON1.1 81.41,118.4 R9.1 81.7,116.44 v81.81,116.33
  Bottom 0.406: v81.81,116.33 81.81,116.08 83.72,114.17 85.29,114.17 87.12,112.34 87.12,81.43 106.3,62.26 106.3,60.48 104.19,58.37 102.92,58.37 IC2.19
DIF_A
  Top 0.406: IC1.6 100.97,119.51 101.78,118.69 103.24,118.69 R38.1 105.5,116.61 106.4,116.61 109.22,113.79 TXRX_IN.2
  Bottom 0.406: TXRX_IN.2 109.22,107.95 114.3,102.87 114.3,92.71 113.03,91.44 110.49,91.44 109.22,92.71 TXRX_OUT.2
DIF_B
  Top 0.406: IC1.7 99.64,120.66 99.64,118.8 100.97,117.47 102.56,117.47 103.35,116.69 103.35,115.57 104.3,114.62 R38.2 105.41,113.03 106.68,111.76 110.49,111.76 | 110.49,111.76 111.12,111.76 TXRX_IN.1 | TXRX_OUT.1 113.67,94.61 115.57,96.52 115.57,102.87 110.49,107.95 110.49,111.76
DIR
  Top 0.406: R43.2 100.97,112.08 IC1.3 IC1.2 99.69,112.32 95.33,107.95 95.33,88.98 92.71,86.36 92.71,68.58 96.52,64.77 96.52,59.69 IC2.21 95.25,58.75
EXTRA1  (via drill 0.6)
  Top 0.406: IC2.13 v81.28,25.4
  Bottom 0.406: X2.7 82.55,24.13 v81.28,25.4
EXTRA2  (via drill 0.6)
  Top 0.406: IC2.10 v78.74,33.02
  Bottom 0.406: X2.6 80.01,31.75 v78.74,33.02
EXTRA3  (via drill 0.6)
  Top 0.406: v78.74,45.72 100.33,45.72 IC2.15
  Bottom 0.406: X2.5 77.47,44.45 v78.74,45.72
EXTRA4  (via drill 0.6)
  Top 0.406: v76.2,46.99 99.06,46.99 IC2.16
  Bottom 0.406: X2.4 74.93,45.72 v76.2,46.99
EXTRA5  (via drill 0.6)
  Top 0.406: v73.66,48.26 97.79,48.26 IC2.17
  Bottom 0.406: X2.3 72.39,46.99 v73.66,48.26
EXTRA6  (via drill 0.6)
  Top 0.406: v71.12,49.53 96.52,49.53 IC2.18
  Bottom 0.406: X2.2 69.85,48.26 v71.12,49.53
G1
  Top 0.813: Q2.2 35.56,25.7 32.31,22.45 21.06,22.45 20.19,23.32 19.23,23.32 PWM1.4 18.44,23.5 17.45,22.5 16.79,22.5 PWM1.5
G2
  Top 0.813: PWM2.5 17.2,40.01 18.47,41.27 PWM2.4 21.72,41.27 22.89,40.11 32.03,40.11 33.55,41.63 33.55,42.4 Q9.2
G3
  Top 0.813: PWM3.5 16.97,57.78 18.06,58.88 18.87,58.88 PWM3.4 21.67,59.05 22.76,57.96 31.33,57.96 Q16.2
GND  (via drill 0.6)
  other vias: 73.66,92.71 69.85,69.85 106.73,119.05 105.44,78 96.95,84 109.68,62.23 124.92,33.02 109.68,33.02 123.65,53.34 60.96,127 26.67,127 53.34,10.16 100.33,20.32 105.41,8.89 3.81,68.58 7.62,116.84 7.62,22.86 123.19,82.55 92.71,111.76 82.55,73.66 83.82,36.83 91.44,34.29 32,106.88 25.43,69.39 22,48.62 50.57,48.82
  pour Top (isolate 0.508): 0,139.7 128.27,139.7 128.27,0 0,0
  pour Bottom (isolate 0.508): 0,139.7 128.27,139.7 128.27,0 0,0
LED1
  Top 0.406: IC2.25 88.9,64.77 88.9,87.63 93.98,92.71 93.98,101.6 92.71,102.87 R8.1
LED2  (via drill 0.6)
  Top 0.406: R7.1 84.18,113.03 v85.34,111.86 | v96.52,69.85 97.89,68.48 97.89,58.52 IC2.22
  Bottom 0.406: v85.34,111.86 85.34,97.48 86.23,96.6 86.23,80.06 86.31,80.06 v96.52,69.85
LED3  (via drill 0.6)
  Top 0.406: v85.09,123.19 R6.1 | v103.76,66.7 103.76,61.85 IC2.20
  Bottom 0.406: v85.09,123.19 85.24,123.19 86.94,121.49 86.94,121.41 88.85,119.51 88.85,81.61 v103.76,66.7
N$1
  Top 0.406: PWR.A R1.1
N$2
  Top 0.406: R25.2 36.33,15.66 34.98,17.02 34.63,17.02 R14.1 34.29,17.78 33.02,19.05 33.28,19.31 Q2.1
N$3
  Top 0.406: Q18.G 24.98,112.72 R47.1 R48.1
N$4
  Top 0.813: IC3.2 115.14,51.03 113.61,49.51 113.61,48.71 D3.C 115.81,48.69 L1.2
N$5
  Top 1.27: POWER.+ 115.57,21.44 119.69,25.55 122.38,25.55 124.36,27.53 124.36,28.77 D1.A
N$6
  Top 0.406: R50.1 R49.1 35.14,112.72 Q19.G
N$7
  Top 0.813: R39.1 106.32,127 109.25,124.08 109.25,121.31 TXRX_IN.8
  Bottom 0.406: TXRX_OUT.8 110.49,103.5 TXRX_OUT.7 TXRX_OUT.5 | TXRX_OUT.4 110.49,98.42 TXRX_OUT.5 | TXRX_IN.8 110.49,121.28 TXRX_IN.7 TXRX_IN.5 | TXRX_IN.5 111.45,117.47 110.06,116.08 109.35,116.08 TXRX_IN.4 | TXRX_OUT.8 109.22,103.61 107.52,105.31 107.52,115.32 108.51,116.31 109.12,116.31 TXRX_IN.4 | TXRX_OUT.5 TXRX_OUT.3 | TXRX_OUT.8 TXRX_OUT.6 | TXRX_IN.4 TXRX_IN.6 | TXRX_IN.5 TXRX_IN.3
N$8
  Top 0.406: R26.2 45.33,15.66 43.69,17.3 43.24,17.3 R15.1 43.18,17.65 42.29,18.54 42.29,19.21 Q3.1
N$9
  Top 0.406: 44.71,112.8 44.71,112.35 | 44.71,112.8 Q20.G | 44.71,112.8 45.3,112.21 R51.1 R52.1
N$10
  Top 0.406: Q8.1 24.39,36.15 R27.1 25.8,35.14 27.38,33.55 27.83,33.55 R40.2
N$11
  Top 0.406: LED3.C 81.5,102.77 R8.2
N$12
  Top 0.406: Q9.1 33.28,36.15 R28.1 34.69,35.14 36.17,33.66 36.62,33.66 R41.2
N$13
  Top 0.406: Q13.G 45.3,94.94 R34.1 R35.1
N$14
  Top 0.406: Q10.1 42.17,36.15 R29.1 43.5,35.14 44.93,33.71 45.45,33.71 R42.2
N$15
  Top 0.406: Q14.G 56.73,93.67 R36.1 R37.1
N$16
  Top 0.406: Q15.1 24.39,53.93 R44.1 25.62,52.92 27.28,51.26 27.9,51.26 R55.2
N$17
  Top 0.406: 54.61,113.03 54.87,113.29 Q21.G 55.46,112.72 R53.1 R54.1
N$18
  Top 0.406: Q16.1 33.28,53.93 R45.1 34.58,52.92 36.2,51.31 36.74,51.31 R56.2
N$19
  Top 0.406: Q1.1 24.39,18.37 R13.1 25.69,17.07 26.11,17.07 27.52,15.66 R24.2
N$20
  Top 0.406: LED2.C 81.5,112.93 R7.2
N$21
  Top 0.406: Q17.1 42.17,53.93 R46.1 43.62,52.92 45.19,51.36 45.58,51.36 R57.2
N$22
  Top 0.406: R19.1 R18.1 35.14,77.16 Q5.G
N$23
  Top 0.406: R21.1 R20.1 45.3,77.16 Q6.G
N$24
  Top 0.406: R17.1 R16.1 24.82,75.09 24.82,76.78 24.39,77.21 Q4.G
N$25
  Top 0.406: R23.1 R22.1 55.46,77.16 Q7.G
N$26
  Top 0.406: Q11.G 24.98,94.94 R30.1 R31.1
N$27
  Top 0.406: Q12.G 35.14,94.94 R32.1 R33.1
N$28
  Top 0.406: R6.2 81.6,120.75 LED1.C
P1  (via drill 0.6)
  Top 0.406: R16.2 23.28,73.67 24.74,72.21 27.79,72.21 v27.89,72.31
  Bottom 0.406: IC2.37 36.7,63.5 v27.89,72.31
P1+
  Top 0.813: PIXEL1-1.8 20.22,76.83 21.92,78.54 21.92,80.3 Q4.D
  Bottom 0.813: PIXEL1-1.8 17.78,76.83 PIXEL1-1.7
P2  (via drill 0.6)
  Top 0.406: 40.11,68.61 53.31,68.61 v59.69,62.23 | 40.11,68.61 40.11,68.63 | R18.2 33.44,73.19 38.02,68.61 40.11,68.61
  Bottom 0.406: IC2.36 77.47,59.69 76.2,58.42 63.5,58.42 v59.69,62.23
P2+  (via drill 0.6)
  Top 0.813: v31.22,82.45 34.75,82.45 36.75,84.45 36.75,84.97 Q5.D
  Bottom 0.813: PIXEL1-1.5 16.87,81 17.45,81 18.36,81.92 PIXEL1-1.4 30.68,81.92 v31.22,82.45
P3  (via drill 0.6)
  Top 0.406: R20.2 43.6,73.6 46.43,70.76 48.08,70.76 v48.26,70.59
  Bottom 0.406: IC2.35 74.93,66.04 52.81,66.04 v48.26,70.59
P3+  (via drill 0.6)
  Top 0.813: PIXEL1-1.1 17.78,85.72 PIXEL1-1.2 | v42.11,84.4 46.34,84.4 Q6.D
  Bottom 0.813: PIXEL1-1.2 42.06,84.45 v42.11,84.4
P4  (via drill 0.6)
  Top 0.406: 65.99,57.2 v66.04,57.15 66.12,57.23 66.12,57.73 61.9,61.95 61.9,65.96 53.95,73.91 53.95,74.74 R22.2
  Bottom 0.406: v66.04,57.15 77.47,57.15 80.01,59.69 IC2.34
P4+  (via drill 0.6)
  Top 0.813: v52.55,84.76 56.86,84.76 Q7.D
  Bottom 0.813: 20.42,79.38 PIXEL1-1.6 | 20.42,79.38 47.17,79.38 v52.55,84.76 | PIXEL1-1.3 15.44,83.19 14.15,81.89 14.15,76.89 16.74,74.3 19.99,74.3 21.92,76.22 21.92,77.88 20.42,79.38
P5  (via drill 0.6)
  Top 0.406: R30.2 23.28,91.12 24.21,90.19 27.91,90.19 v27.94,90.17
  Bottom 0.406: v27.94,90.17 29.77,90.17 32.41,87.53 55.98,87.53 IC2.33
P5+
  Top 0.813: PIXEL5-1.8 20.78,94.61 21.92,95.76 21.92,98.08 Q11.D
  Bottom 0.813: PIXEL5-1.7 16.51,95.25 17.78,93.98 18.41,93.98 PIXEL5-1.8
P6  (via drill 0.6)
  Top 0.406: v62.97,83.06 62.97,62.76 v69.85,55.88 | v33.98,89.94 33.98,90.07 33.25,90.81 33.25,92.52 R32.2
  Bottom 0.406: v69.85,55.88 78.74,55.88 82.55,59.69 IC2.32 | v62.97,83.06 62.97,83.21 57.15,89.03 35.03,89.03 34.11,89.94 v33.98,89.94
P6+  (via drill 0.6)
  Top 0.813: v31.01,99.67 32.36,99.67 36.83,104.14 Q12.D
  Bottom 0.813: PIXEL5-1.5 17.78,99.69 PIXEL5-1.4 30.99,99.69 v31.01,99.67
P7  (via drill 0.6)
  Top 0.406: R34.2 43.6,91.76 45.06,90.3 48.13,90.3 v48.26,90.17
  Bottom 0.406: IC2.31 82.55,66.04 58.42,90.17 v48.26,90.17
P7+  (via drill 0.6)
  Top 0.813: v41.83,102.21 46.37,102.21 Q13.D
  Bottom 0.813: PIXEL5-1.1 16.84,103.83 17.02,103.83 18.62,102.23 PIXEL5-1.2 41.81,102.23 v41.83,102.21
P8
  Top 0.406: IC2.26 90.17,58.42 86.36,54.61 73.66,54.61 64.26,64.01 64.26,86.08 60.2,90.14 56.06,90.14 55.03,91.17 R36.2
P8+  (via drill 0.6)
  Top 0.813: v52.35,102.21 56.49,102.21 57.15,102.87 Q14.D
  Bottom 0.813: 20.65,97.16 PIXEL5-1.6 | 20.65,97.16 47.3,97.16 v52.35,102.21 | PIXEL5-1.3 15.14,100.97 14.12,99.95 14.12,94.44 16.33,92.23 20.27,92.23 22.02,93.98 22.02,95.78 20.65,97.16
P9
  Top 0.406: IC2.0 54.61,64.77 52.07,67.31 21.59,67.31 13.18,75.67 13.11,103.35 17.78,107.95 20.74,107.95 R47.2
P9+
  Top 0.813: PIXEL9-1.8 20.47,112.39 21.51,113.44 21.51,117.58 24.84,120.9 26.38,120.9 Q18.D
  Bottom 0.813: PIXEL9-1.7 16.51,113.28 17.65,112.14 18.8,112.14 PIXEL9-1.8
P10  (via drill 0.6)
  Top 0.406: v85.09,55.88 74.93,55.88 65.05,65.76 65.05,86.51 63.02,88.54 63.02,104.29 60.63,106.68 36.37,106.68 33.66,109.4 33.66,110.28 R49.2 | v90.17,55.88 92.71,58.42 IC2.24
  Bottom 0.406: v85.09,55.88 v90.17,55.88
P10+  (via drill 0.6)
  Top 0.813: v31.62,117.45 33.67,117.45 Q19.D
  Bottom 0.813: PIXEL9-1.5 16.54,116.18 17.17,116.18 18.47,117.47 PIXEL9-1.4 31.6,117.47 v31.62,117.45
P11
  Top 0.406: IC2.28 87.88,60.71 87.88,60.4 84.58,57.1 75.56,57.1 65.73,66.93 65.73,87.12 64.92,87.94 64.92,104.6 61.57,107.95 45.29,107.95 43.33,109.91 43.33,110.22 R51.2
P11+  (via drill 0.6)
  Top 0.813: v42.67,119.99 47.6,119.99 48.26,120.65 | 48.26,120.65 48.26,119.38 | 48.26,120.65 47.03,120.65 Q20.D
  Bottom 0.813: PIXEL9-1.1 17.78,121.28 PIXEL9-1.2 42.65,120.02 v42.67,119.99
P12
  Top 0.406: IC2.27 85.09,66.04 80.01,66.04 66.42,79.63 66.42,104.93 62.41,108.94 54.43,108.94 53.65,109.73 53.65,110.38 R53.2
P12+  (via drill 0.6)
  Top 0.813: v51.94,120.09 56.63,120.09 Q21.D
  Bottom 0.813: 21.11,114.94 PIXEL9-1.6 | 21.11,114.94 46.79,114.94 v51.94,120.09 | PIXEL9-1.3 15.21,118.75 13.79,117.32 13.79,112.55 15.8,110.54 20.4,110.54 21.72,111.86 21.72,114.33 21.11,114.94
PWM_B1  (via drill 0.6)
  Top 0.406: v40.31,15.29 42.81,15.29 R15.2
  Bottom 0.406: IC2.14 45.34,20.32 v40.31,15.29
PWM_B2  (via drill 0.6)
  Top 0.406: v40.64,33.02 42.76,33.02 R29.2
  Bottom 0.406: IC2.8 45.72,38.1 v40.64,33.02
PWM_B3  (via drill 0.6)
  Top 0.406: v40.26,51.08 43.04,51.08 R46.2
  Bottom 0.406: IC2.3 42.52,53.34 v40.26,51.08
PWM_G1  (via drill 0.6)
  Top 0.406: v31.83,15.34 33.97,15.34 R14.2
  Bottom 0.406: IC2.12 44.42,27.94 v31.83,15.34
PWM_G2  (via drill 0.6)
  Top 0.406: v31.55,33.22 34.07,33.22 R28.2
  Bottom 0.406: IC2.7 41.5,43.18 v31.55,33.22
PWM_G3  (via drill 0.6)
  Top 0.406: v31.75,50.98 34.05,50.98 R45.2
  Bottom 0.406: IC2.2 36.65,55.88 v31.75,50.98
PWM_R1  (via drill 0.6)
  Top 0.406: v22.86,15.24 24.98,15.24 R13.2
  Bottom 0.406: IC2.11 38.1,30.48 v22.86,15.24
PWM_R2  (via drill 0.6)
  Top 0.406: v22.45,33.3 25.26,33.3 R27.2
  Bottom 0.406: IC2.6 34.87,45.72 v22.45,33.3
PWM_R3  (via drill 0.6)
  Top 0.406: v22.63,50.98 25.16,50.98 R44.2
  Bottom 0.406: IC2.1 30.07,58.42 v22.63,50.98
R1
  Top 0.813: PWM1.1 17.78,27.3 PWM1.2 26.07,26.04 Q1.2
R2
  Top 0.813: Q8.2 19.64,44.41 PWM2.2 17.78,45.09 PWM2.1
R3
  Top 0.813: PWM3.1 17.78,62.87 PWM3.2 26.07,61.59 Q15.2
RESET  (via drill 0.6)
  Top 0.406: RESET.2 RESET.1 81.41,81.57 R12.1 81.7,80.53 82.65,79.58 83.92,79.58 84.84,80.49 84.84,93.73 v90.17,99.06
  Bottom 0.406: IC2.RST 107.95,35.56 107.95,64.77 90.17,82.55 v90.17,99.06
RX  (via drill 0.6)
  Top 0.406: IC1.1 98.42,113.44 v98.37,113.39 | v87.66,72.03 87.27,72.42 87.27,89.81 v92.71,95.25
  Bottom 0.406: v98.37,113.39 98.37,95.68 97.94,95.25 v92.71,95.25 | X2.9 87.63,40.64 82.55,45.72 82.55,57.15 85.09,59.69 IC2.30 87.86,58.19 92.15,58.19 94.59,60.63 94.59,65.1 v87.66,72.03
SCL
  Top 0.406: IC4.7 102.23,86.79 101.37,87.66 97.87,87.66 95.25,85.04 95.25,80.01 96.1,79.16 R4.2 99.52,76.16 99.52,56.44 95.89,52.81 60.02,52.81 55.37,48.16 54.71,48.16 IC2.5
SDA
  Top 0.406: IC4.1 100.97,79.27 100.28,78.59 100.1,78.59 | R5.2 99.63,78.59 100.1,78.59 | 100.1,78.59 100.74,77.95 100.74,55.5 96.22,50.98 64.95,50.98 58.42,44.45 58.42,38.1 55.88,35.56 IC2.9 54.71,35.66
TX  (via drill 0.6)
  Top 0.406: IC1.4 102.23,113.51 v102.18,113.46 | 86.26,68.4 v86.33,68.33 85.88,68.78 85.88,93.14 89.28,96.55 v91.44,96.55 | v92.2,54.25 92.2,56.79 93.4,57.99 93.4,59.46 94.82,60.88 94.82,63.93 92.46,66.29 v91.52,66.29
  Bottom 0.406: v102.18,113.46 102.18,95.63 100.53,93.98 95.25,93.98 93.98,92.71 92.71,92.71 91.44,93.98 v91.44,96.55 | 85.09,65.13 IC2.29 84.94,63.65 84.94,66.93 v86.33,68.33 88.37,66.29 v91.52,66.29 | v92.2,54.25 92.2,51.31 95.25,48.26 95.25,11.43 91.44,7.62 86.36,7.62 85.09,8.89 X2.8

### Text on the board
tPlace: PIXELS9-12 | PIXELS5-8 | PIXELS1-4 | RGB3 | RGB2 | RGB1 | 5V | EXTRA6 | EXTRA5 | EXTRA4 | EXTRA3 | EXTRA2 | EXTRA1 | TX | RX | GND | - | +
tNames: LED CONTROLLER v1.0